# EAGLE schematic CPU (EAGLE 7.5.0), part 5 of 7
## Module OR_MATRIX
Ports: LOAD_A_FROM_DATABUS_SETAB(in) LOAD_A_FROM_DATABUS_MOV_ALU_C_TO_AB(in) LOAD_A_FROM_DATABUS_MOV_ALU_IN(in) LOAD_A_FROM_DATABUS(out) LOAD_B_FROM_DATABUS_MOV_ALU_IN(in) LOAD_B_FROM_DATABUS_SETAB(in) LOAD_B_FROM_DATABUS_MOV_ALU_C_TO_AB(in) LOAD_B_FROM_DATABUS(out) LOAD_C_FROM_DATABUS(out) LOAD_C_FROM_DATABUS_ALU(in) LOAD_D_FROM_DATABUS_MOV_ALU_OUT(in) LOAD_D_FROM_DATABUS_LOAD(in) LOAD_D_FROM_DATABUS_MOV(in) LOAD_D_FROM_DATABUS(out) LOAD_E_FROM_DATABUS_MOV_ALU_OUT(in) LOAD_E_FROM_DATABUS_LOAD(in) LOAD_E_FROM_DATABUS_MOV(in) LOAD_E_FROM_DATABUS(out) LOAD_F_FROM_DATABUS_MOV(in) LOAD_F_FROM_DATABUS_LOAD(in) LOAD_F_FROM_DATABUS_MOV_ALU_OUT(in) LOAD_F_FROM_DATABUS(out) LOAD_G_FROM_DATABUS_MOV(in) LOAD_G_FROM_DATABUS_LOAD(in) LOAD_G_FROM_DATABUS_MOV_ALU_OUT(in) LOAD_G_FROM_DATABUS(out) LOAD_H_FROM_DATABUS_MOV(in) LOAD_H_FROM_DATABUS_LOAD(in) LOAD_H_FROM_DATABUS_MOV_ALU_OUT(in) LOAD_H_FROM_DATABUS(out) LOAD_XL_FROM_DATABUS_MOV(in) LOAD_XL_FROM_DATABUS_LOAD(in) LOAD_XL_FROM_DATABUS_MOV_ALU_OUT(in) LOAD_XL_FROM_DATABUS_IN(in) LOAD_XL_FROM_DATABUS(out) LOAD_XH_FROM_DATABUS_MOV(in) LOAD_XH_FROM_DATABUS_LOAD(in) LOAD_XH_FROM_DATABUS_MOV_ALU_OUT(in) LOAD_XH_FROM_DATABUS(out) LOAD_M_FROM_ADDRESSBUS_MOV16(in) LOAD_M_FROM_ADDRESSBUS(out) LOAD_X_FROM_ADDRESSBUS_MOV16(in) LOAD_X_FROM_ADDRESSBUS_ADDER_16BIT(in) LOAD_X_FROM_ADDRESSBUS(out) LOAD_J_FROM_ADDRESSBUS_MOV16(in) LOAD_J_FROM_ADDRESSBUS(out) LOAD_SP_FROM_ADDRESSBUS_MOV16(in) LOAD_SP_FROM_ADDRESSBUS(out) LOAD_BP_FROM_ADDRESSBUS_MOV16(in) LOAD_BP_FROM_ADDRESSBUS(out) LOAD_Y_FROM_ADDRESSBUS_MOV16(in) LOAD_Z_FROM_ADDRESSBUS_MOV16(in) LOAD_Y_FROM_ADDRESSBUS(out) LOAD_Z_FROM_ADDRESSBUS(out) SELECT_C_TO_DATABUS_MOV_ALU_OUT(in) SELECT_C_TO_DATABUS_MOV_ALU_C_TO_AB(in) SELECT_C_TO_DATABUS(out) SELECT_D_TO_DATABUS_MOV_ALU_IN(in) SELECT_D_TO_DATABUS_MOV(in) SELECT_D_TO_DATABUS_STORE(in) SELECT_D_TO_DATABUS(out) SELECT_E_TO_DATABUS_MOV(in) SELECT_E_TO_DATABUS_STORE(in) SELECT_E_TO_DATABUS_MOV_ALU_IN(in) SELECT_E_TO_DATABUS(out) SELECT_F_TO_DATABUS_MOV(in) SELECT_F_TO_DATABUS_STORE(in) SELECT_F_TO_DATABUS_MOV_ALU_IN(in) SELECT_F_TO_DATABUS(out) SELECT_G_TO_DATABUS_MOV_ALU_IN(in) SELECT_G_TO_DATABUS_MOV(in) SELECT_G_TO_DATABUS_STORE(in) SELECT_G_TO_DATABUS(out) SELECT_H_TO_DATABUS_MOV_ALU_IN(in) SELECT_H_TO_DATABUS_MOV(in) SELECT_H_TO_DATABUS_STORE(in) SELECT_H_TO_DATABUS(out) SELECT_XL_TO_DATABUS_MOV_ALU_IN(in) SELECT_XL_TO_DATABUS_MOV(in) SELECT_XL_TO_DATABUS_STORE(in) SELECT_XL_TO_DATABUS_OUT(in) SELECT_XL_TO_DATABUS(out) SELECT_XH_TO_DATABUS_MOV_ALU_IN(in) SELECT_XH_TO_DATABUS_MOV(in) SELECT_XH_TO_DATABUS_STORE(in) SELECT_XH_TO_DATABUS(out) SELECT_M_TO_ADDRESSBUS_MOV16(in) SELECT_M_TO_ADDRESSBUS_LOAD(in) SELECT_M_TO_ADDRESSBUS_STORE(in) SELECT_M_TO_ADDRESSBUS_STORE_FLAGS(in) SELECT_M_TO_ADDRESSBUS_LOAD_FLAGS(in) SELECT_X_TO_ADDRESSBUS_MOV16(in) SELECT_X_TO_ADDRESSBUS_ADDER_16BIT(in) SELECT_M_TO_ADDRESSBUS(out) SELECT_X_TO_ADDRESSBUS(out) SELECT_SP_TO_ADDRESSBUS_MOV16(in) SELECT_SP_TO_ADDRESSBUS(out) SELECT_BP_TO_ADDRESSBUS_MOV16(in) SELECT_BP_TO_ADDRESSBUS(out) SELECT_Y_TO_ADDRESSBUS_MOV16(in) SELECT_Z_TO_ADDRESSBUS_MOV16(in) SELECT_Y_TO_ADDRESSBUS(out) SELECT_Z_TO_ADDRESSBUS(out) SELECT_J_TO_ADDRESSBUS_MOV16(in) SELECT_J_TO_ADDRESSBUS_JMP(in) SELECT_J_TO_ADDRESSBUS_JZ(in) SELECT_J_TO_ADDRESSBUS_JNS(in) SELECT_J_TO_ADDRESSBUS_JNZ(in) SELECT_J_TO_ADDRESSBUS_JNC(in) SELECT_J_TO_ADDRESSBUS_ADDER_16BIT(in) SELECT_J_TO_ADDRESSBUS(out) SELECT_FLAGS_JZ(in) SELECT_FLAGS_JNC(in) SELECT_FLAGS_JNS(in) SELECT_FLAGS_JNZ(in) SELECT_FLAGS_FLAGS_TO_OUTBUFFER(in) SELECT_FLAGS_SAVE_FLAGS(in) SELECT_FLAGS(out) LOAD_FLAGS_FROM_ALU(in) LOAD_FLAGS_INBUFFER_TO_FLAGS(in) LOAD_FLAGS_SAVE_FLAGS(in) LOAD_FLAGS(out) SELECT_SRAM_FETCH(in) SELECT_SRAM_LOAD(in) SELECT_SRAM_LOAD_FLAGS(in) SELECT_SRAM(out) LOAD_SRAM_STORE(in) LOAD_SRAM_STORE_FLAGS(in) LOAD_SRAM(out) LOAD_PC_FETCH(in) LOAD_PC_JMP(in) LOAD_PC_JZ(in) LOAD_PC_JNS(in) LOAD_PC_JNC(in) LOAD_PC_JNZ(in) LOAD_PC(out) SELECT_PC_FETCH(in) SELECT_PC(out) SELECT_FLAGSTOFLAGSBUS_INBUFFER_TO_FLAGS(in) SELECT_FLAGSTOFLAGSBUS(out) SELECT_FLAGS_TO_DATABUS_STORE_FLAGS(in) SELECT_FLAGS_TO_DATABUS(out) LOAD_FLAGS_FROM_DATABUS_LOAD_FLAGS(in) LOAD_FLAGS_FROM_DATABUS(out) LOAD_FLAGSSAVED_TO_FLAGS_REGISTER_RESTORE_FLAGS(in) LOAD_FLAGSSAVED_TO_FLAGS_REGISTER(out) LOAD_FLAGSSAVED_FROM_FLAGS_REGISTER_SAVE_FLAGS(in) LOAD_FLAGSSAVED_FROM_FLAGS_REGISTER(out) LOAD_PORTC_FROM_DATABUS_OUT(in) LOAD_PORTD_FROM_DATABUS_OUT(in) LOAD_PORTC_FROM_DATABUS(out) LOAD_PORTD_FROM_DATABUS(out) SELECT_PORTA_TO_DATABUS_IN(in) SELECT_PORTB_TO_DATABUS_IN(in) SELECT_PORTA_TO_DATABUS(out) SELECT_PORTB_TO_DATABUS(out) LOAD_ADDER16BIT_INPUTA_ADDER16BIT(in) LOAD_ADDER16BIT_INPUTB_ADDER16BIT(in) LOAD_ADDER16BIT_INPUTA(out) LOAD_ADDER16BIT_INPUTB(out) SELECT_ADDER16BIT_INPUTA_ADDER16BIT(in) SELECT_ADDER16BIT_INPUTB_ADDER16BIT(in) SELECT_ADDER16BIT_INPUTA(out) SELECT_ADDER16BIT_INPUTB(out) LOAD_ADDER16BIT_OUTPUTC_ADDER16BIT(in) SELECT_ADDER16BIT_OUTPUTC_ADDER16BIT(in) LOAD_ADDER16BIT_OUTPUTC(out) SELECT_ADDER16BIT_OUTPUTC(out) ENABLE_ALU_DECODER_ALU(in) SELECT_INSTRUCTION_TO_ALU_ALU(in) SELECT_B_TO_ALU_ALU(in) SELECT_A_TO_ALU_ALU(in) SELECT_A_TO_ALU(out) SELECT_B_TO_ALU(out) LOAD_INTERNALA_FROM_DATABUS_SETAB(in) LOAD_INTERNALA_FROM_DATABUS(out) SELECT_INTERNALA_TO_DATABUS_SETAB(in) SELECT_INTERNALA_TO_DATABUS(out) SELECT_INSTR_TO_DATABUS_SETAB(in) SELECT_INSTR_TO_DATABUS(out) STOPCPU_HLT(in) STOPCPU(out) LOAD_INSTRUCTION_FETCH(in) LOAD_INSTRUCTION(out) SELECT_INC_FETCH(in) SELECT_INC(out) LOAD_INC_FETCH(in) LOAD_INC(out) INCREMENTER_FETCH(in) INCREMENTER(out) LOAD_FLAGS_FROM_FLAGSBUS_FLAGS_TO_OUTBUFFER(in) LOAD_FLAGS_FROM_FLAGSBUS(out) SELECT_XE_TO_DATABUS_MOV_ALU_IN(in) SELECT_XE_TO_DATABUS_MOV(in) SELECT_XE_TO_DATABUS_STORE(in) SELECT_XE_TO_DATABUS(out) LOAD_XE_FROM_DATABUS_MOV_ALU_OUT(in) LOAD_XE_FROM_DATABUS_LOAD(in) LOAD_XE_FROM_DATABUS_MOV(in) LOAD_XE_FROM_DATABUS(out) ALU_INSTRUCTION(out)
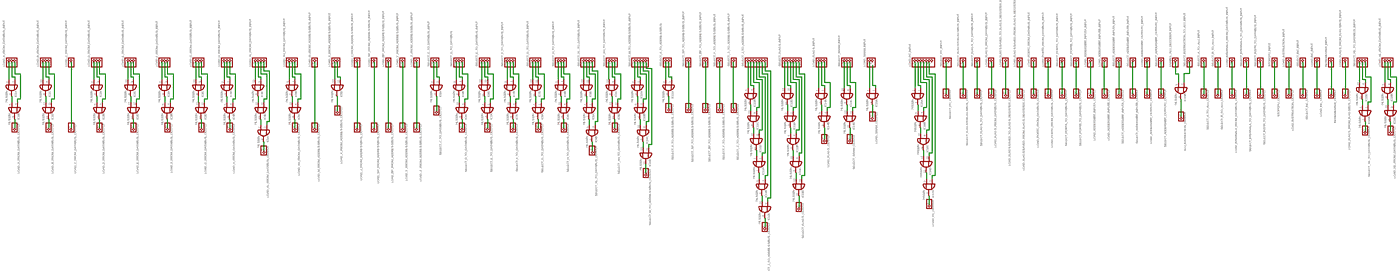
[diagram p74: schematic, module OR_MATRIX, sheet 1, overview]
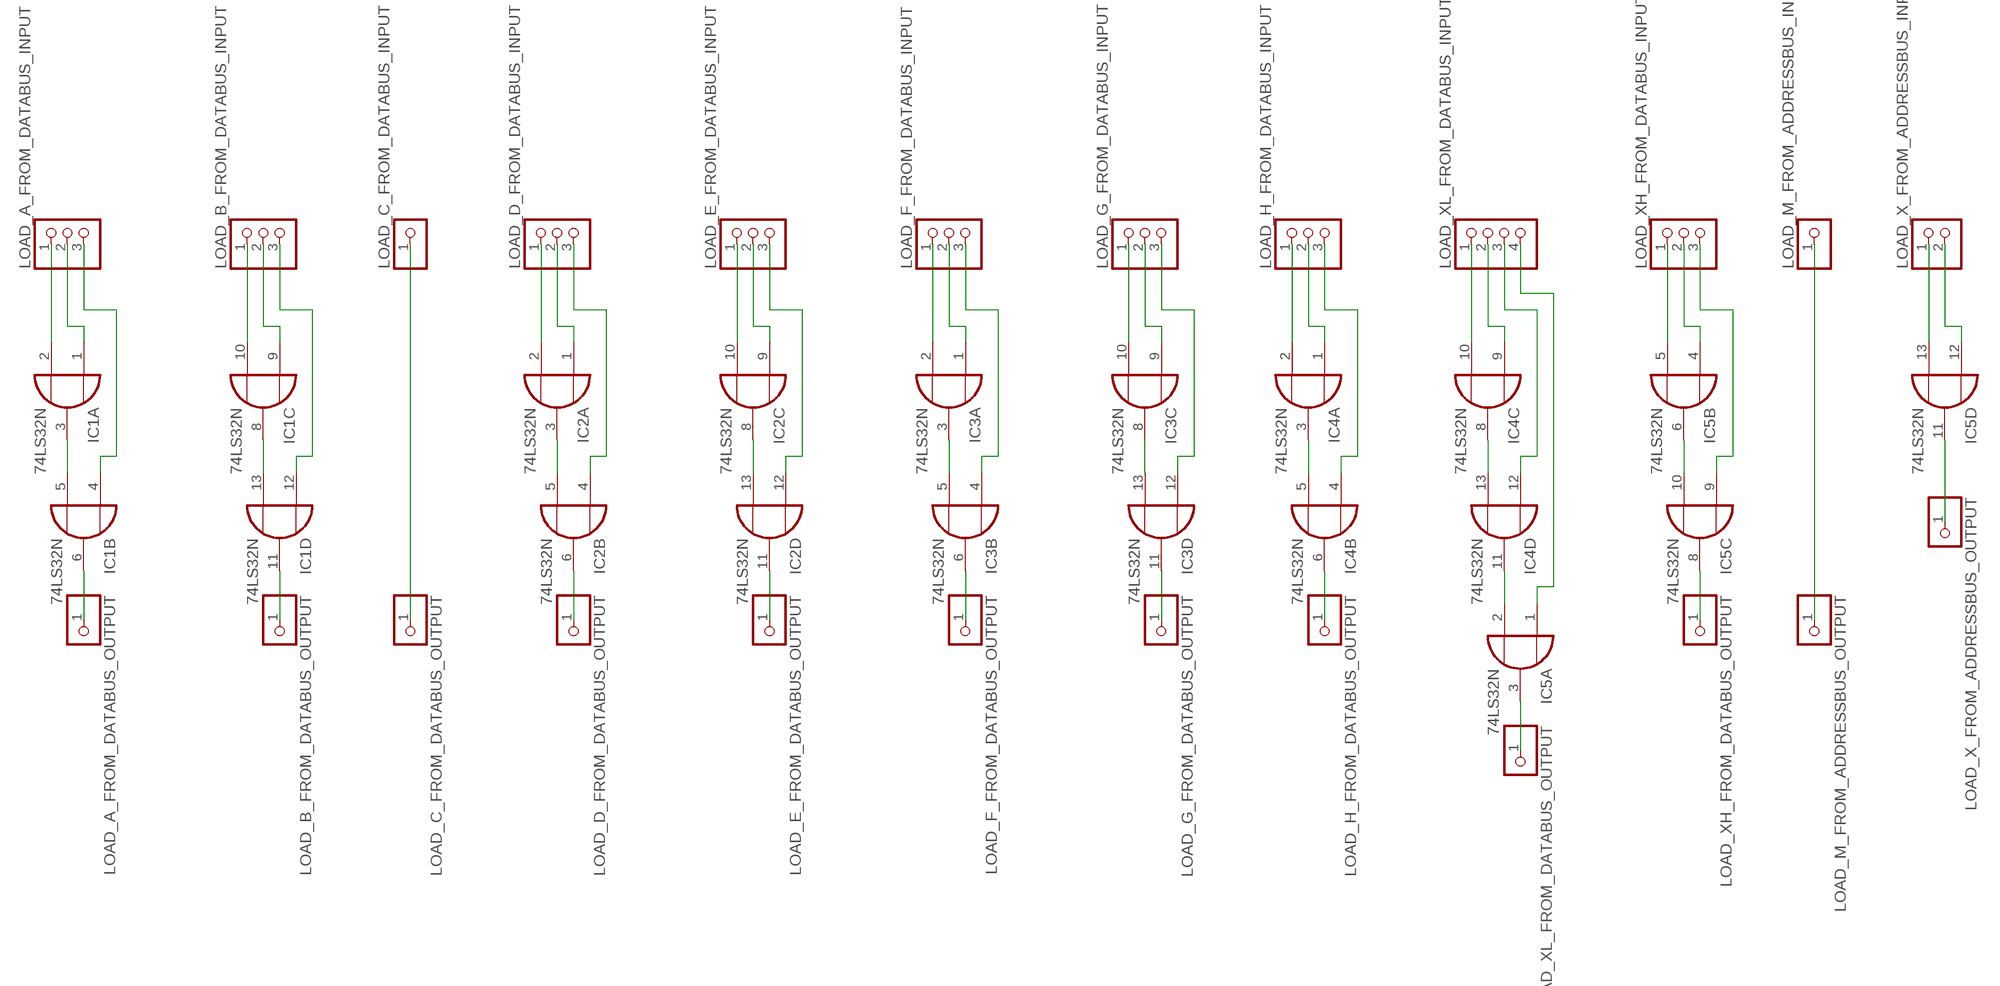
[diagram p75: schematic, module OR_MATRIX, sheet 1, part 1 of 4]
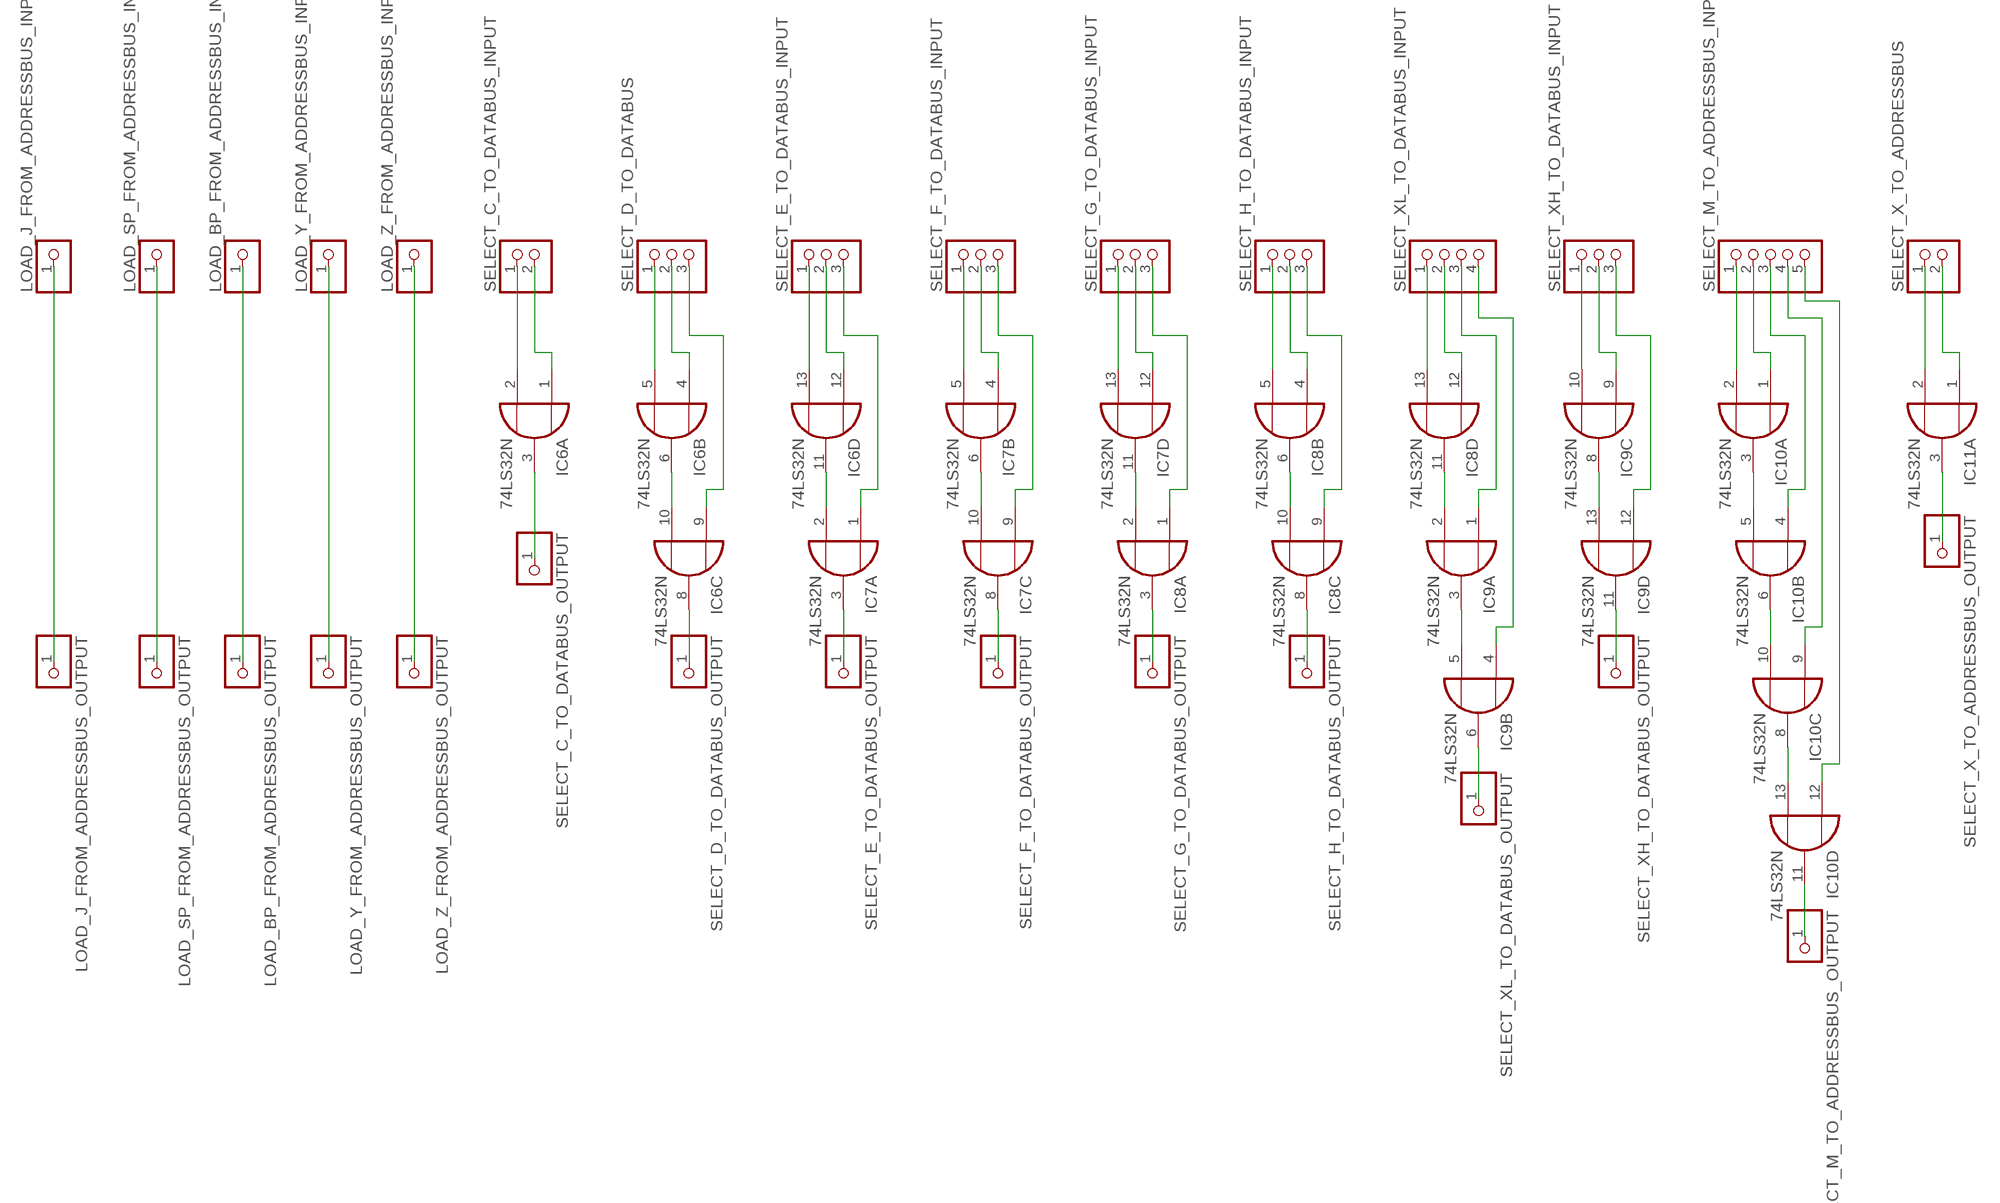
[diagram p76: schematic, module OR_MATRIX, sheet 1, part 2 of 4]
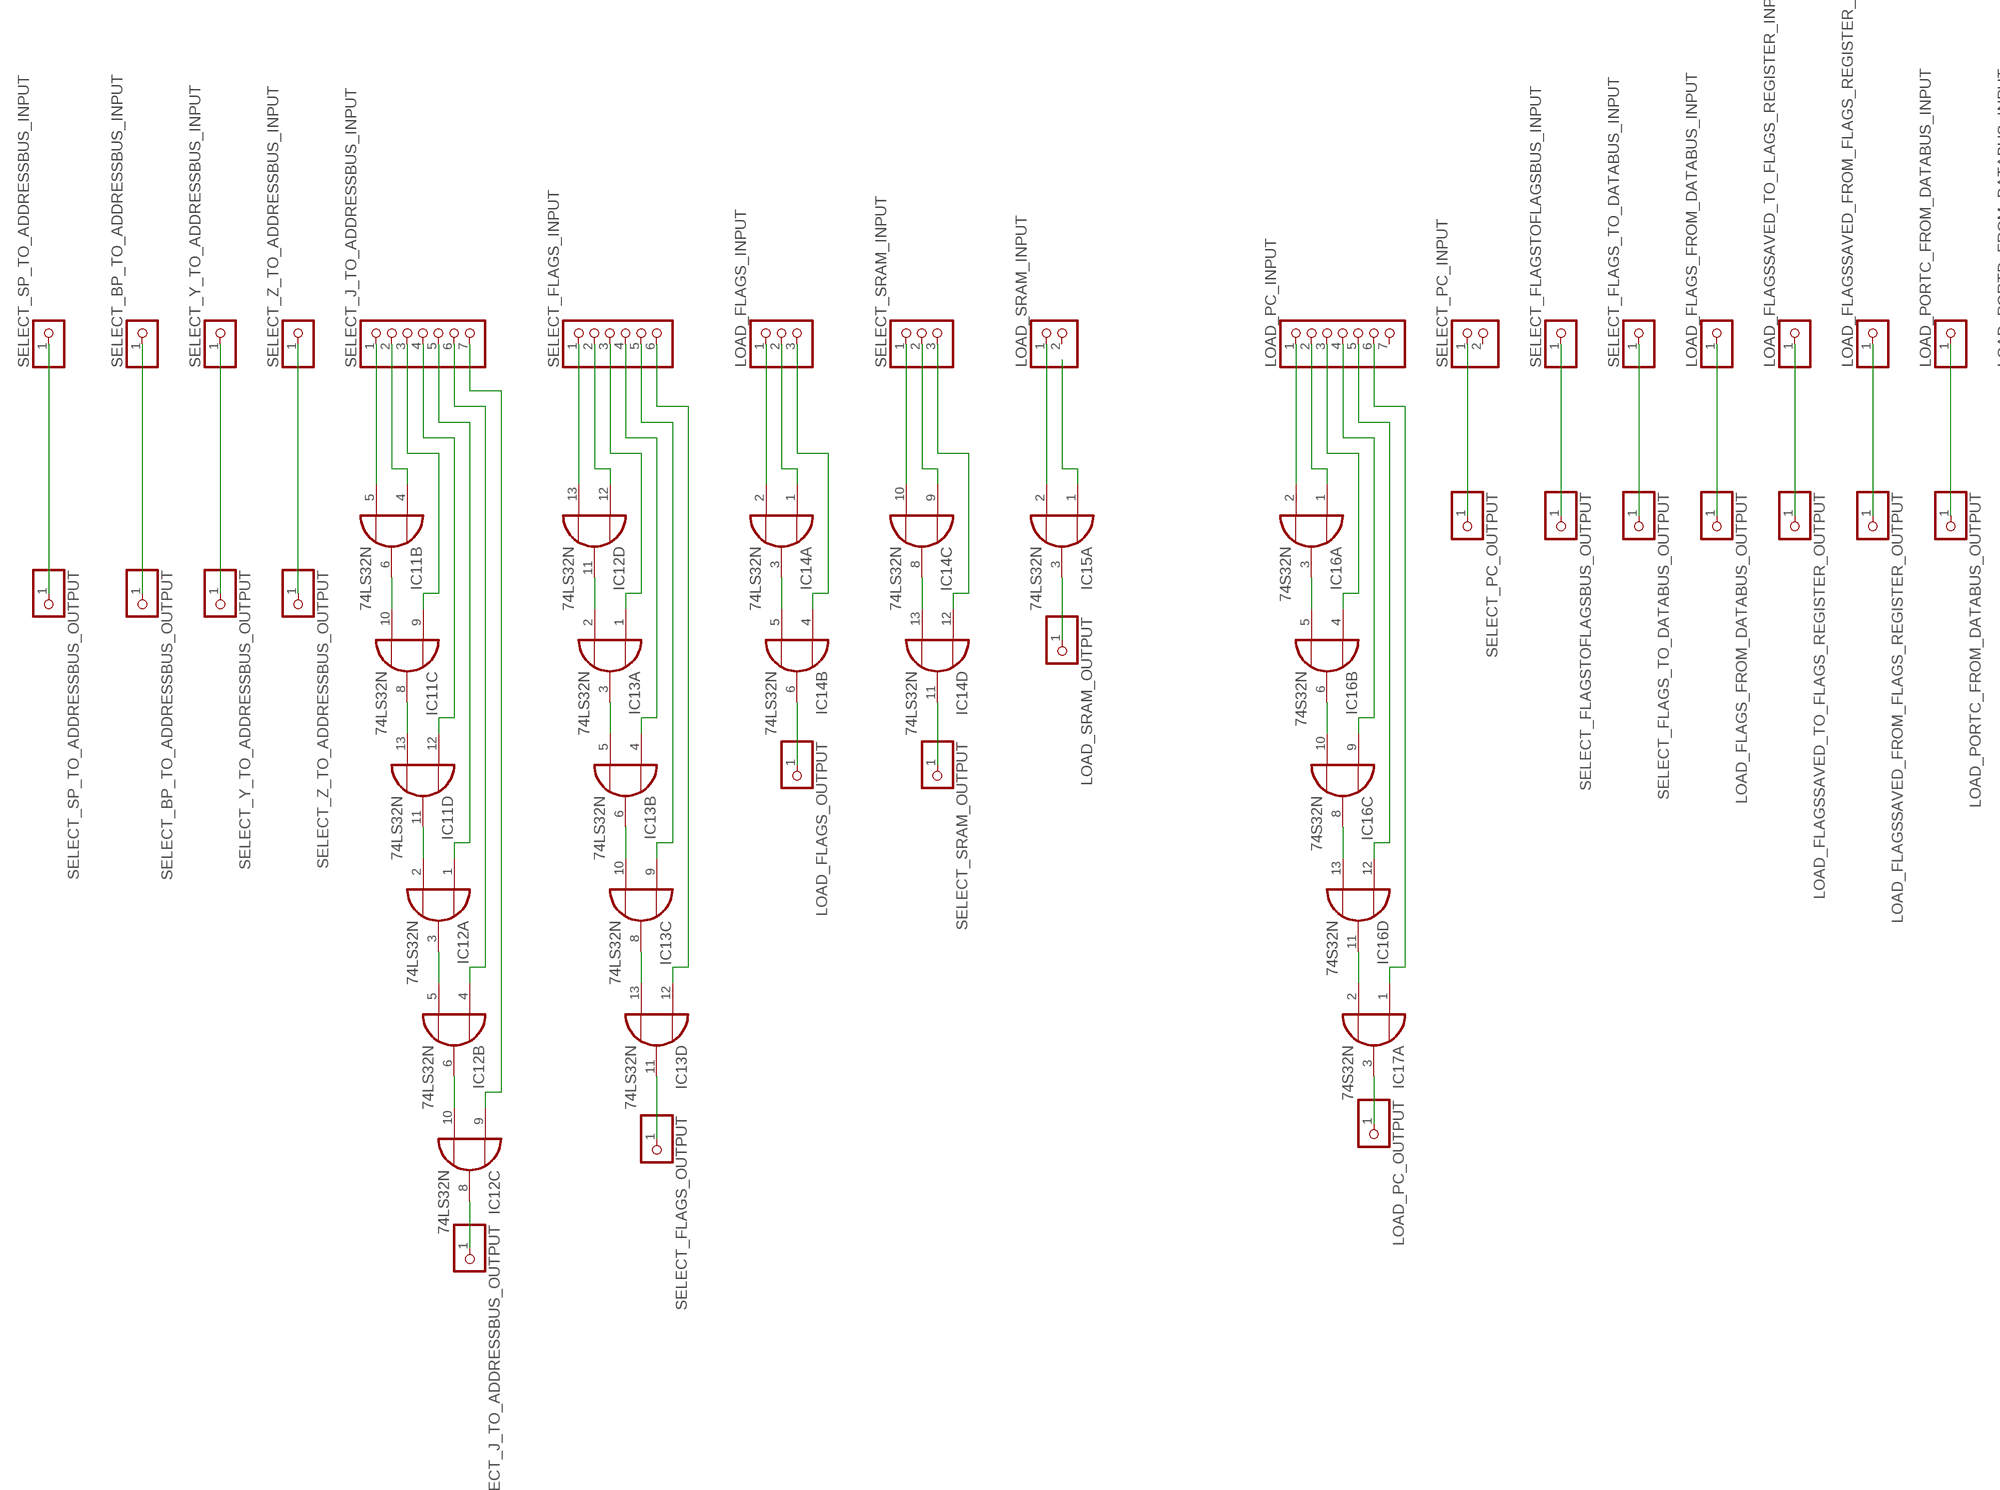
[diagram p77: schematic, module OR_MATRIX, sheet 1, part 3 of 4]
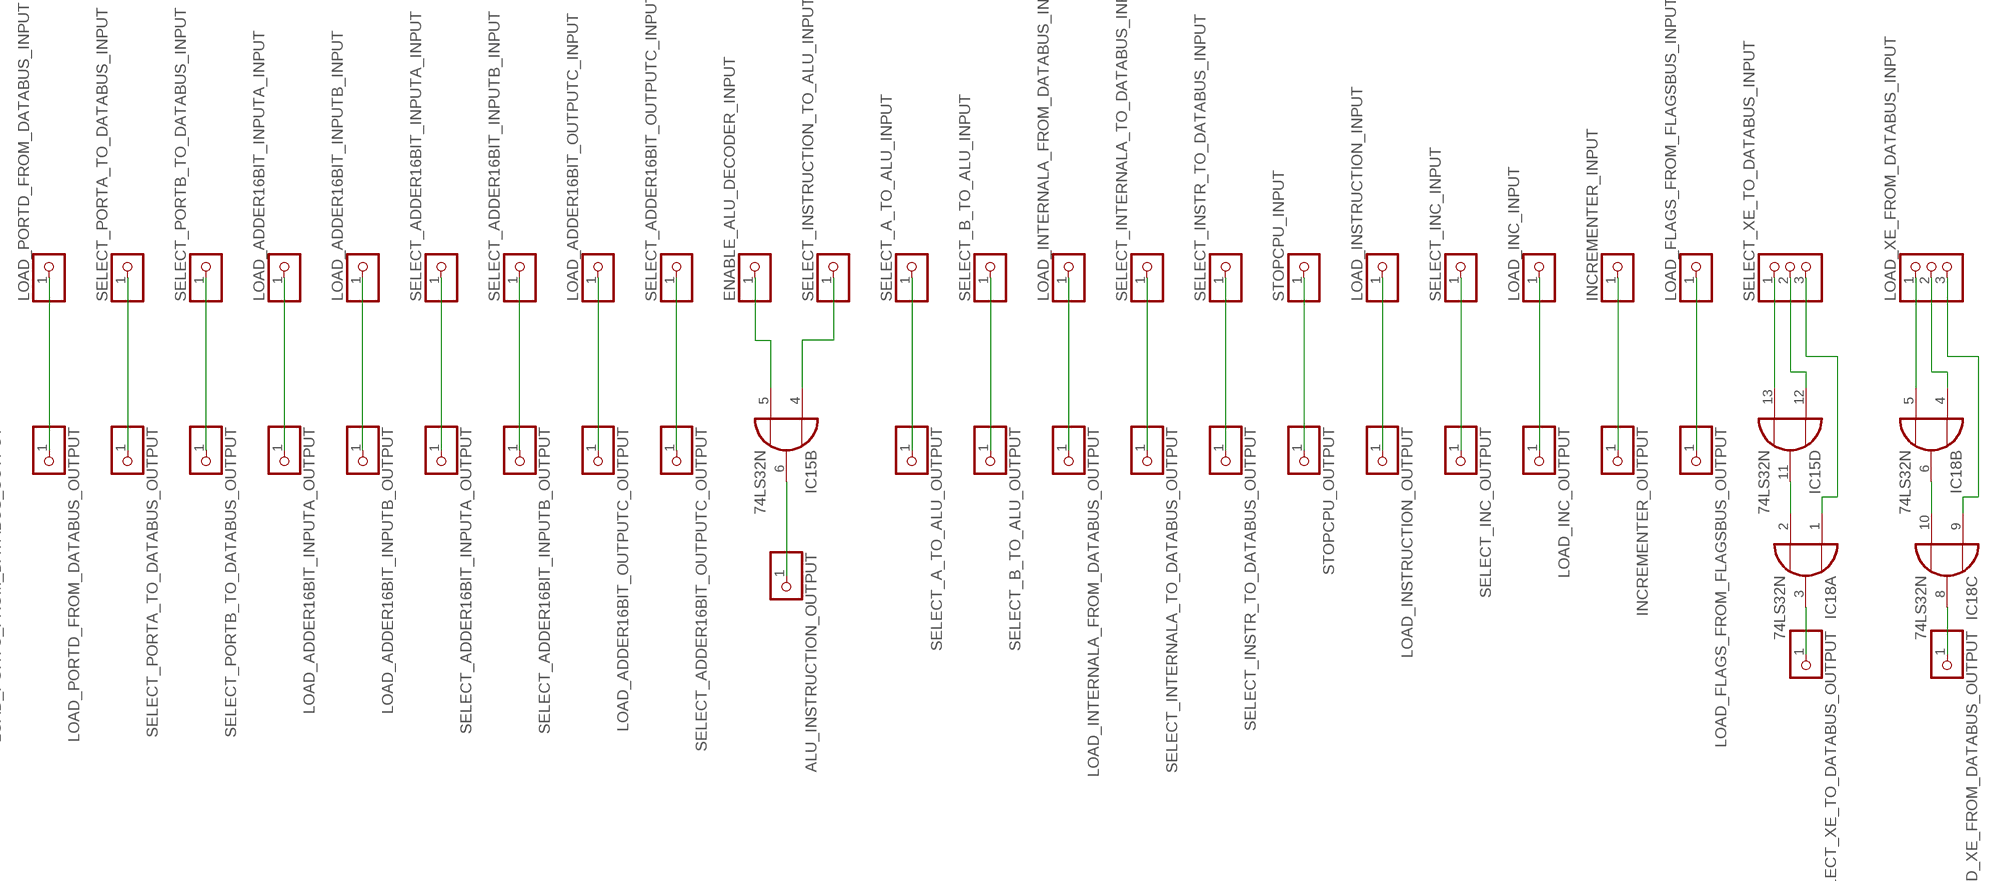
[diagram p78: schematic, module OR_MATRIX, sheet 1, part 4 of 4]

### Parts
ALU_INSTRUCTION_OUTPUT  PINHD-1X1  [1X01]
ENABLE_ALU_DECODER_INPUT  PINHD-1X1  [1X01]
IC1  74LS32N  [DIL14]
IC2  74LS32N  [DIL14]
IC3  74LS32N  [DIL14]
IC4  74LS32N  [DIL14]
IC5  74LS32N  [DIL14]
IC6  74LS32N  [DIL14]
IC7  74LS32N  [DIL14]
IC8  74LS32N  [DIL14]
IC9  74LS32N  [DIL14]
IC10  74LS32N  [DIL14]
IC11  74LS32N  [DIL14]
IC12  74LS32N  [DIL14]
IC13  74LS32N  [DIL14]
IC14  74LS32N  [DIL14]
IC15  74LS32N  [DIL14]
IC16  74S32N  [DIL14]
IC17  74S32N  [DIL14]
IC18  74LS32N  [DIL14]
INCREMENTER_INPUT  PINHD-1X1  [1X01]
INCREMENTER_OUTPUT  PINHD-1X1  [1X01]
LOAD_A_FROM_DATABUS_INPUT  PINHD-1X3  [1X03]
LOAD_A_FROM_DATABUS_OUTPUT  PINHD-1X1  [1X01]
LOAD_ADDER16BIT_INPUTA_INPUT  PINHD-1X1  [1X01]
LOAD_ADDER16BIT_INPUTA_OUTPUT  PINHD-1X1  [1X01]
LOAD_ADDER16BIT_INPUTB_INPUT  PINHD-1X1  [1X01]
LOAD_ADDER16BIT_INPUTB_OUTPUT  PINHD-1X1  [1X01]
LOAD_ADDER16BIT_OUTPUTC_INPUT  PINHD-1X1  [1X01]
LOAD_ADDER16BIT_OUTPUTC_OUTPUT  PINHD-1X1  [1X01]
LOAD_B_FROM_DATABUS_INPUT  PINHD-1X3  [1X03]
LOAD_B_FROM_DATABUS_OUTPUT  PINHD-1X1  [1X01]
LOAD_BP_FROM_ADDRESSBUS_INPUT  PINHD-1X1  [1X01]
LOAD_BP_FROM_ADDRESSBUS_OUTPUT  PINHD-1X1  [1X01]
LOAD_C_FROM_DATABUS_INPUT  PINHD-1X1  [1X01]
LOAD_C_FROM_DATABUS_OUTPUT  PINHD-1X1  [1X01]
LOAD_D_FROM_DATABUS_INPUT  PINHD-1X3  [1X03]
LOAD_D_FROM_DATABUS_OUTPUT  PINHD-1X1  [1X01]
LOAD_E_FROM_DATABUS_INPUT  PINHD-1X3  [1X03]
LOAD_E_FROM_DATABUS_OUTPUT  PINHD-1X1  [1X01]
LOAD_F_FROM_DATABUS_INPUT  PINHD-1X3  [1X03]
LOAD_F_FROM_DATABUS_OUTPUT  PINHD-1X1  [1X01]
LOAD_FLAGS_FROM_DATABUS_INPUT  PINHD-1X1  [1X01]
LOAD_FLAGS_FROM_DATABUS_OUTPUT  PINHD-1X1  [1X01]
LOAD_FLAGS_FROM_FLAGSBUS_INPUT  PINHD-1X1  [1X01]
LOAD_FLAGS_FROM_FLAGSBUS_OUTPUT  PINHD-1X1  [1X01]
LOAD_FLAGS_INPUT  PINHD-1X3  [1X03]
LOAD_FLAGS_OUTPUT  PINHD-1X1  [1X01]
LOAD_FLAGSSAVED_FROM_FLAGS_REGISTER_INPUT  PINHD-1X1  [1X01]
LOAD_FLAGSSAVED_FROM_FLAGS_REGISTER_OUTPUT  PINHD-1X1  [1X01]
LOAD_FLAGSSAVED_TO_FLAGS_REGISTER_INPUT  PINHD-1X1  [1X01]
LOAD_FLAGSSAVED_TO_FLAGS_REGISTER_OUTPUT  PINHD-1X1  [1X01]
LOAD_G_FROM_DATABUS_INPUT  PINHD-1X3  [1X03]
LOAD_G_FROM_DATABUS_OUTPUT  PINHD-1X1  [1X01]
LOAD_H_FROM_DATABUS_INPUT  PINHD-1X3  [1X03]
LOAD_H_FROM_DATABUS_OUTPUT  PINHD-1X1  [1X01]
LOAD_INC_INPUT  PINHD-1X1  [1X01]
LOAD_INC_OUTPUT  PINHD-1X1  [1X01]
LOAD_INSTRUCTION_INPUT  PINHD-1X1  [1X01]
LOAD_INSTRUCTION_OUTPUT  PINHD-1X1  [1X01]
LOAD_INTERNALA_FROM_DATABUS_INPUT  PINHD-1X1  [1X01]
LOAD_INTERNALA_FROM_DATABUS_OUTPUT  PINHD-1X1  [1X01]
LOAD_J_FROM_ADDRESSBUS_INPUT  PINHD-1X1  [1X01]
LOAD_J_FROM_ADDRESSBUS_OUTPUT  PINHD-1X1  [1X01]
LOAD_M_FROM_ADDRESSBUS_INPUT  PINHD-1X1  [1X01]
LOAD_M_FROM_ADDRESSBUS_OUTPUT  PINHD-1X1  [1X01]
LOAD_PC_INPUT  PINHD-1X7  [1X07]
LOAD_PC_OUTPUT  PINHD-1X1  [1X01]
LOAD_PORTC_FROM_DATABUS_INPUT  PINHD-1X1  [1X01]
LOAD_PORTC_FROM_DATABUS_OUTPUT  PINHD-1X1  [1X01]
LOAD_PORTD_FROM_DATABUS_INPUT  PINHD-1X1  [1X01]
LOAD_PORTD_FROM_DATABUS_OUTPUT  PINHD-1X1  [1X01]
LOAD_SP_FROM_ADDRESSBUS_INPUT  PINHD-1X1  [1X01]
LOAD_SP_FROM_ADDRESSBUS_OUTPUT  PINHD-1X1  [1X01]
LOAD_SRAM_INPUT  PINHD-1X2  [1X02]
LOAD_SRAM_OUTPUT  PINHD-1X1  [1X01]
LOAD_X_FROM_ADDRESSBUS_INPUT  PINHD-1X2  [1X02]
LOAD_X_FROM_ADDRESSBUS_OUTPUT  PINHD-1X1  [1X01]
LOAD_XE_FROM_DATABUS_INPUT  PINHD-1X3  [1X03]
LOAD_XE_FROM_DATABUS_OUTPUT  PINHD-1X1  [1X01]
LOAD_XH_FROM_DATABUS_INPUT  PINHD-1X3  [1X03]
LOAD_XH_FROM_DATABUS_OUTPUT  PINHD-1X1  [1X01]
LOAD_XL_FROM_DATABUS_INPUT  PINHD-1X4  [1X04]
LOAD_XL_FROM_DATABUS_OUTPUT  PINHD-1X1  [1X01]
LOAD_Y_FROM_ADDRESSBUS_INPUT  PINHD-1X1  [1X01]
LOAD_Y_FROM_ADDRESSBUS_OUTPUT  PINHD-1X1  [1X01]
LOAD_Z_FROM_ADDRESSBUS_INPUT  PINHD-1X1  [1X01]
LOAD_Z_FROM_ADDRESSBUS_OUTPUT  PINHD-1X1  [1X01]
SELECT_A_TO_ALU_INPUT  PINHD-1X1  [1X01]
SELECT_A_TO_ALU_OUTPUT  PINHD-1X1  [1X01]
SELECT_ADDER16BIT_INPUTA_INPUT  PINHD-1X1  [1X01]
SELECT_ADDER16BIT_INPUTA_OUTPUT  PINHD-1X1  [1X01]
SELECT_ADDER16BIT_INPUTB_INPUT  PINHD-1X1  [1X01]
SELECT_ADDER16BIT_INPUTB_OUTPUT  PINHD-1X1  [1X01]
SELECT_ADDER16BIT_OUTPUTC_INPUT  PINHD-1X1  [1X01]
SELECT_ADDER16BIT_OUTPUTC_OUTPUT  PINHD-1X1  [1X01]
SELECT_B_TO_ALU_INPUT  PINHD-1X1  [1X01]
SELECT_B_TO_ALU_OUTPUT  PINHD-1X1  [1X01]
SELECT_BP_TO_ADDRESSBUS_INPUT  PINHD-1X1  [1X01]
SELECT_BP_TO_ADDRESSBUS_OUTPUT  PINHD-1X1  [1X01]
SELECT_C_TO_DATABUS_INPUT  PINHD-1X2  [1X02]
SELECT_C_TO_DATABUS_OUTPUT  PINHD-1X1  [1X01]
SELECT_D_TO_DATABUS  PINHD-1X3  [1X03]
SELECT_D_TO_DATABUS_OUTPUT  PINHD-1X1  [1X01]
SELECT_E_TO_DATABUS_INPUT  PINHD-1X3  [1X03]
SELECT_E_TO_DATABUS_OUTPUT  PINHD-1X1  [1X01]
SELECT_F_TO_DATABUS_INPUT  PINHD-1X3  [1X03]
SELECT_F_TO_DATABUS_OUTPUT  PINHD-1X1  [1X01]
SELECT_FLAGS_INPUT  PINHD-1X6  [1X06]
SELECT_FLAGS_OUTPUT  PINHD-1X1  [1X01]
SELECT_FLAGS_TO_DATABUS_INPUT  PINHD-1X1  [1X01]
SELECT_FLAGS_TO_DATABUS_OUTPUT  PINHD-1X1  [1X01]
SELECT_FLAGSTOFLAGSBUS_INPUT  PINHD-1X1  [1X01]
SELECT_FLAGSTOFLAGSBUS_OUTPUT  PINHD-1X1  [1X01]
SELECT_G_TO_DATABUS_INPUT  PINHD-1X3  [1X03]
SELECT_G_TO_DATABUS_OUTPUT  PINHD-1X1  [1X01]
SELECT_H_TO_DATABUS_INPUT  PINHD-1X3  [1X03]
SELECT_H_TO_DATABUS_OUTPUT  PINHD-1X1  [1X01]
SELECT_INC_INPUT  PINHD-1X1  [1X01]
SELECT_INC_OUTPUT  PINHD-1X1  [1X01]
SELECT_INSTR_TO_DATABUS_INPUT  PINHD-1X1  [1X01]
SELECT_INSTR_TO_DATABUS_OUTPUT  PINHD-1X1  [1X01]
SELECT_INSTRUCTION_TO_ALU_INPUT  PINHD-1X1  [1X01]
SELECT_INTERNALA_TO_DATABUS_INPUT  PINHD-1X1  [1X01]
SELECT_INTERNALA_TO_DATABUS_OUTPUT  PINHD-1X1  [1X01]
SELECT_J_TO_ADDRESSBUS_INPUT  PINHD-1X7  [1X07]
SELECT_J_TO_ADDRESSBUS_OUTPUT  PINHD-1X1  [1X01]
SELECT_M_TO_ADDRESSBUS_INPUT  PINHD-1X5  [1X05]
SELECT_M_TO_ADDRESSBUS_OUTPUT  PINHD-1X1  [1X01]
SELECT_PC_INPUT  PINHD-1X2  [1X02]
SELECT_PC_OUTPUT  PINHD-1X1  [1X01]
SELECT_PORTA_TO_DATABUS_INPUT  PINHD-1X1  [1X01]
SELECT_PORTA_TO_DATABUS_OUTPUT  PINHD-1X1  [1X01]
SELECT_PORTB_TO_DATABUS_INPUT  PINHD-1X1  [1X01]
SELECT_PORTB_TO_DATABUS_OUTPUT  PINHD-1X1  [1X01]
SELECT_SP_TO_ADDRESSBUS_INPUT  PINHD-1X1  [1X01]
SELECT_SP_TO_ADDRESSBUS_OUTPUT  PINHD-1X1  [1X01]
SELECT_SRAM_INPUT  PINHD-1X3  [1X03]
SELECT_SRAM_OUTPUT  PINHD-1X1  [1X01]
SELECT_X_TO_ADDRESSBUS  PINHD-1X2  [1X02]
SELECT_X_TO_ADDRESSBUS_OUTPUT  PINHD-1X1  [1X01]
SELECT_XE_TO_DATABUS_INPUT  PINHD-1X3  [1X03]
SELECT_XE_TO_DATABUS_OUTPUT  PINHD-1X1  [1X01]
SELECT_XH_TO_DATABUS_INPUT  PINHD-1X3  [1X03]
SELECT_XH_TO_DATABUS_OUTPUT  PINHD-1X1  [1X01]
SELECT_XL_TO_DATABUS_INPUT  PINHD-1X4  [1X04]
SELECT_XL_TO_DATABUS_OUTPUT  PINHD-1X1  [1X01]
SELECT_Y_TO_ADDRESSBUS_INPUT  PINHD-1X1  [1X01]
SELECT_Y_TO_ADDRESSBUS_OUTPUT  PINHD-1X1  [1X01]
SELECT_Z_TO_ADDRESSBUS_INPUT  PINHD-1X1  [1X01]
SELECT_Z_TO_ADDRESSBUS_OUTPUT  PINHD-1X1  [1X01]
STOPCPU_INPUT  PINHD-1X1  [1X01]
STOPCPU_OUTPUT  PINHD-1X1  [1X01]

### Nets
ALU_INSTRUCTION: ALU_INSTRUCTION_OUTPUT.1 IC15.6(B:O)
INCREMENTER: INCREMENTER_INPUT.1 INCREMENTER_OUTPUT.1
LOAD_A_FROM_DATABUS: IC1.6(B:O) LOAD_A_FROM_DATABUS_OUTPUT.1
LOAD_A_FROM_DATABUS_MOV_ALU_C_TO_AB: IC1.4(B:I0) LOAD_A_FROM_DATABUS_INPUT.3
LOAD_A_FROM_DATABUS_MOV_ALU_IN: IC1.1(A:I0) LOAD_A_FROM_DATABUS_INPUT.2
LOAD_A_FROM_DATABUS_SETAB: IC1.2(A:I1) LOAD_A_FROM_DATABUS_INPUT.1
LOAD_ADDER16BIT_INPUTA: LOAD_ADDER16BIT_INPUTA_INPUT.1 LOAD_ADDER16BIT_INPUTA_OUTPUT.1
LOAD_ADDER16BIT_INPUTB: LOAD_ADDER16BIT_INPUTB_INPUT.1 LOAD_ADDER16BIT_INPUTB_OUTPUT.1
LOAD_ADDER16BIT_OUTPUTC: LOAD_ADDER16BIT_OUTPUTC_INPUT.1 LOAD_ADDER16BIT_OUTPUTC_OUTPUT.1
LOAD_B_FROM_DATABUS: IC1.11(D:O) LOAD_B_FROM_DATABUS_OUTPUT.1
LOAD_B_FROM_DATABUS_MOV_ALU_C_TO_AB: IC1.12(D:I0) LOAD_B_FROM_DATABUS_INPUT.3
LOAD_B_FROM_DATABUS_MOV_ALU_IN: IC1.9(C:I0) LOAD_B_FROM_DATABUS_INPUT.2
LOAD_B_FROM_DATABUS_SETAB: IC1.10(C:I1) LOAD_B_FROM_DATABUS_INPUT.1
LOAD_BP_FROM_ADDRESSBUS: LOAD_BP_FROM_ADDRESSBUS_INPUT.1 LOAD_BP_FROM_ADDRESSBUS_OUTPUT.1
LOAD_C_FROM_DATABUS_ALU: LOAD_C_FROM_DATABUS_INPUT.1 LOAD_C_FROM_DATABUS_OUTPUT.1
LOAD_D_FROM_DATABUS: IC2.6(B:O) LOAD_D_FROM_DATABUS_OUTPUT.1
LOAD_D_FROM_DATABUS_LOAD: IC2.4(B:I0) LOAD_D_FROM_DATABUS_INPUT.3
LOAD_D_FROM_DATABUS_MOV: IC2.1(A:I0) LOAD_D_FROM_DATABUS_INPUT.2
LOAD_D_FROM_DATABUS_MOV_ALU_OUT: IC2.2(A:I1) LOAD_D_FROM_DATABUS_INPUT.1
LOAD_E_FROM_DATABUS: IC2.11(D:O) LOAD_E_FROM_DATABUS_OUTPUT.1
LOAD_E_FROM_DATABUS_LOAD: IC2.12(D:I0) LOAD_E_FROM_DATABUS_INPUT.3
LOAD_E_FROM_DATABUS_MOV: IC2.9(C:I0) LOAD_E_FROM_DATABUS_INPUT.2
LOAD_E_FROM_DATABUS_MOV_ALU_OUT: IC2.10(C:I1) LOAD_E_FROM_DATABUS_INPUT.1
LOAD_F_FROM_DATABUS: IC3.6(B:O) LOAD_F_FROM_DATABUS_OUTPUT.1
LOAD_F_FROM_DATABUS_LOAD: IC3.4(B:I0) LOAD_F_FROM_DATABUS_INPUT.3
LOAD_F_FROM_DATABUS_MOV: IC3.1(A:I0) LOAD_F_FROM_DATABUS_INPUT.2
LOAD_F_FROM_DATABUS_MOV_ALU_OUT: IC3.2(A:I1) LOAD_F_FROM_DATABUS_INPUT.1
LOAD_FLAGS: IC14.6(B:O) LOAD_FLAGS_OUTPUT.1
LOAD_FLAGS_FROM_ALU: IC14.2(A:I1) LOAD_FLAGS_INPUT.1
LOAD_FLAGS_FROM_DATABUS: LOAD_FLAGS_FROM_DATABUS_INPUT.1 LOAD_FLAGS_FROM_DATABUS_OUTPUT.1
LOAD_FLAGS_FROM_FLAGSBUS: LOAD_FLAGS_FROM_FLAGSBUS_INPUT.1 LOAD_FLAGS_FROM_FLAGSBUS_OUTPUT.1
LOAD_FLAGS_INBUFFER_TO_FLAGS: IC14.4(B:I0) LOAD_FLAGS_INPUT.3
LOAD_FLAGS_SAVE_FLAGS: IC14.1(A:I0) LOAD_FLAGS_INPUT.2
LOAD_FLAGSSAVED_FROM_FLAGS_REGISTER: LOAD_FLAGSSAVED_FROM_FLAGS_REGISTER_INPUT.1 LOAD_FLAGSSAVED_FROM_FLAGS_REGISTER_OUTPUT.1
LOAD_FLAGSSAVED_TO_FLAGS_REGISTER: LOAD_FLAGSSAVED_TO_FLAGS_REGISTER_INPUT.1 LOAD_FLAGSSAVED_TO_FLAGS_REGISTER_OUTPUT.1
LOAD_G_FROM_DATABUS: IC3.11(D:O) LOAD_G_FROM_DATABUS_OUTPUT.1
LOAD_G_FROM_DATABUS_LOAD: IC3.12(D:I0) LOAD_G_FROM_DATABUS_INPUT.3
LOAD_G_FROM_DATABUS_MOV: IC3.9(C:I0) LOAD_G_FROM_DATABUS_INPUT.2
LOAD_G_FROM_DATABUS_MOV_ALU_OUT: IC3.10(C:I1) LOAD_G_FROM_DATABUS_INPUT.1
LOAD_H_FROM_DATABUS: IC4.6(B:O) LOAD_H_FROM_DATABUS_OUTPUT.1
LOAD_H_FROM_DATABUS_LOAD: IC4.4(B:I0) LOAD_H_FROM_DATABUS_INPUT.3
LOAD_H_FROM_DATABUS_MOV: IC4.1(A:I0) LOAD_H_FROM_DATABUS_INPUT.2
LOAD_H_FROM_DATABUS_MOV_ALU_OUT: IC4.2(A:I1) LOAD_H_FROM_DATABUS_INPUT.1
LOAD_INC: LOAD_INC_INPUT.1 LOAD_INC_OUTPUT.1
LOAD_INSTRUCTION: LOAD_INSTRUCTION_INPUT.1 LOAD_INSTRUCTION_OUTPUT.1
LOAD_INTERNALA_FROM_DATABUS: LOAD_INTERNALA_FROM_DATABUS_INPUT.1 LOAD_INTERNALA_FROM_DATABUS_OUTPUT.1
LOAD_J_FROM_ADDRESSBUS: LOAD_J_FROM_ADDRESSBUS_INPUT.1 LOAD_J_FROM_ADDRESSBUS_OUTPUT.1
LOAD_M_FROM_ADDRESSBUS: LOAD_M_FROM_ADDRESSBUS_INPUT.1 LOAD_M_FROM_ADDRESSBUS_OUTPUT.1
LOAD_PC: LOAD_PC_OUTPUT.1
LOAD_PC_FETCH: IC16.2(A:I1) LOAD_PC_INPUT.1
LOAD_PC_JMP: IC16.1(A:I0) LOAD_PC_INPUT.2
LOAD_PC_JNC: IC17.1(A:I0) LOAD_PC_INPUT.6
LOAD_PC_JNS: IC16.9(C:I0) LOAD_PC_INPUT.4
LOAD_PC_JNZ: IC16.12(D:I0) LOAD_PC_INPUT.5
LOAD_PC_JZ: IC16.4(B:I0) LOAD_PC_INPUT.3
LOAD_PORTC_FROM_DATABUS: LOAD_PORTC_FROM_DATABUS_INPUT.1 LOAD_PORTC_FROM_DATABUS_OUTPUT.1
LOAD_PORTD_FROM_DATABUS: LOAD_PORTD_FROM_DATABUS_INPUT.1 LOAD_PORTD_FROM_DATABUS_OUTPUT.1
LOAD_SP_FROM_ADDRESSBUS: LOAD_SP_FROM_ADDRESSBUS_INPUT.1 LOAD_SP_FROM_ADDRESSBUS_OUTPUT.1
LOAD_SRAM: IC15.3(A:O) LOAD_SRAM_OUTPUT.1
LOAD_SRAM_STORE: IC15.2(A:I1) LOAD_SRAM_INPUT.1
LOAD_SRAM_STORE_FLAGS: IC15.1(A:I0)
LOAD_X_FROM_ADDRESSBUS: IC5.11(D:O) LOAD_X_FROM_ADDRESSBUS_OUTPUT.1
LOAD_X_FROM_ADDRESSBUS_ADDER_16BIT: IC5.12(D:I0) LOAD_X_FROM_ADDRESSBUS_INPUT.2
LOAD_X_FROM_ADDRESSBUS_MOV16: IC5.13(D:I1) LOAD_X_FROM_ADDRESSBUS_INPUT.1
LOAD_XE_FROM_DATABUS: IC18.8(C:O) LOAD_XE_FROM_DATABUS_OUTPUT.1
LOAD_XE_FROM_DATABUS_LOAD: IC18.9(C:I0) LOAD_XE_FROM_DATABUS_INPUT.3
LOAD_XE_FROM_DATABUS_MOV: IC18.4(B:I0) LOAD_XE_FROM_DATABUS_INPUT.2
LOAD_XE_FROM_DATABUS_MOV_ALU_OUT: IC18.5(B:I1) LOAD_XE_FROM_DATABUS_INPUT.1
LOAD_XH_FROM_DATABUS: IC5.8(C:O) LOAD_XH_FROM_DATABUS_OUTPUT.1
LOAD_XH_FROM_DATABUS_LOAD: IC5.9(C:I0) LOAD_XH_FROM_DATABUS_INPUT.3
LOAD_XH_FROM_DATABUS_MOV: IC5.4(B:I0) LOAD_XH_FROM_DATABUS_INPUT.2
LOAD_XH_FROM_DATABUS_MOV_ALU_OUT: IC5.5(B:I1) LOAD_XH_FROM_DATABUS_INPUT.1
LOAD_XL_FROM_DATABUS: IC5.3(A:O) LOAD_XL_FROM_DATABUS_OUTPUT.1
LOAD_XL_FROM_DATABUS_IN: IC5.1(A:I0) LOAD_XL_FROM_DATABUS_INPUT.4
LOAD_XL_FROM_DATABUS_LOAD: IC4.12(D:I0) LOAD_XL_FROM_DATABUS_INPUT.3
LOAD_XL_FROM_DATABUS_MOV: IC4.9(C:I0) LOAD_XL_FROM_DATABUS_INPUT.2
LOAD_XL_FROM_DATABUS_MOV_ALU_OUT: IC4.10(C:I1) LOAD_XL_FROM_DATABUS_INPUT.1
LOAD_Y_FROM_ADDRESSBUS: LOAD_Y_FROM_ADDRESSBUS_INPUT.1 LOAD_Y_FROM_ADDRESSBUS_OUTPUT.1
LOAD_Z_FROM_ADDRESSBUS: LOAD_Z_FROM_ADDRESSBUS_INPUT.1 LOAD_Z_FROM_ADDRESSBUS_OUTPUT.1
N$1: ENABLE_ALU_DECODER_INPUT.1 IC15.5(B:I1)
N$2: IC4.8(C:O) IC4.13(D:I1)
N$3: IC1.3(A:O) IC1.5(B:I1)
N$4: IC1.8(C:O) IC1.13(D:I1)
N$5: IC2.3(A:O) IC2.5(B:I1)
N$6: IC2.8(C:O) IC2.13(D:I1)
N$7: IC3.3(A:O) IC3.5(B:I1)
N$8: IC3.8(C:O) IC3.13(D:I1)
N$9: IC4.3(A:O) IC4.5(B:I1)
N$10: IC15.4(B:I0) SELECT_INSTRUCTION_TO_ALU_INPUT.1
N$11: IC5.6(B:O) IC5.10(C:I1)
N$12: IC4.11(D:O) IC5.2(A:I1)
N$13: IC6.6(B:O) IC6.10(C:I1)
N$14: IC6.11(D:O) IC7.2(A:I1)
N$15: IC7.6(B:O) IC7.10(C:I1)
N$16: IC7.11(D:O) IC8.2(A:I1)
N$17: IC8.6(B:O) IC8.10(C:I1)
N$18: IC8.11(D:O) IC9.2(A:I1)
N$19: IC9.8(C:O) IC9.13(D:I1)
N$20: IC9.3(A:O) IC9.5(B:I1)
N$21: IC11.6(B:O) IC11.10(C:I1)
N$22: IC10.3(A:O) IC10.5(B:I1)
N$23: IC12.11(D:O) IC13.2(A:I1)
N$24: IC10.6(B:O) IC10.10(C:I1)
N$25: IC11.8(C:O) IC11.13(D:I1)
N$26: IC10.8(C:O) IC10.13(D:I1)
N$27: IC14.3(A:O) IC14.5(B:I1)
N$28: IC11.11(D:O) IC12.2(A:I1)
N$29: IC13.3(A:O) IC13.5(B:I1)
N$30: IC12.3(A:O) IC12.5(B:I1)
N$31: IC14.8(C:O) IC14.13(D:I1)
N$32: IC12.6(B:O) IC12.10(C:I1)
N$33: IC13.6(B:O) IC13.10(C:I1)
N$35: IC13.8(C:O) IC13.13(D:I1)
N$36: IC16.3(A:O) IC16.5(B:I1)
N$37: IC18.6(B:O) IC18.10(C:I1)
N$38: IC16.6(B:O) IC16.10(C:I1)
N$39: IC15.11(D:O) IC18.2(A:I1)
N$40: IC16.8(C:O) IC16.13(D:I1)
N$42: IC16.11(D:O) IC17.2(A:I1)
SELECT_A_TO_ALU: SELECT_A_TO_ALU_INPUT.1 SELECT_A_TO_ALU_OUTPUT.1
SELECT_ADDER16BIT_INPUTA: SELECT_ADDER16BIT_INPUTA_INPUT.1 SELECT_ADDER16BIT_INPUTA_OUTPUT.1
SELECT_ADDER16BIT_INPUTB: SELECT_ADDER16BIT_INPUTB_INPUT.1 SELECT_ADDER16BIT_INPUTB_OUTPUT.1
SELECT_ADDER16BIT_OUTPUTC: SELECT_ADDER16BIT_OUTPUTC_INPUT.1 SELECT_ADDER16BIT_OUTPUTC_OUTPUT.1
SELECT_B_TO_ALU: SELECT_B_TO_ALU_INPUT.1 SELECT_B_TO_ALU_OUTPUT.1
SELECT_BP_TO_ADDRESSBUS: SELECT_BP_TO_ADDRESSBUS_INPUT.1 SELECT_BP_TO_ADDRESSBUS_OUTPUT.1
SELECT_C_TO_DATABUS: IC6.3(A:O) SELECT_C_TO_DATABUS_OUTPUT.1
SELECT_C_TO_DATABUS_MOV_ALU_C_TO_AB: IC6.1(A:I0) SELECT_C_TO_DATABUS_INPUT.2
SELECT_C_TO_DATABUS_MOV_ALU_OUT: IC6.2(A:I1) SELECT_C_TO_DATABUS_INPUT.1
SELECT_D_TO_DATABUS: SELECT_D_TO_DATABUS_OUTPUT.1
SELECT_D_TO_DATABUS_MOV: IC6.4(B:I0) SELECT_D_TO_DATABUS.2
SELECT_D_TO_DATABUS_MOV_ALU_IN: IC6.5(B:I1) SELECT_D_TO_DATABUS.1
SELECT_D_TO_DATABUS_STORE: IC6.9(C:I0) SELECT_D_TO_DATABUS.3
SELECT_E_TO_DATABUS: IC7.3(A:O) SELECT_E_TO_DATABUS_OUTPUT.1
SELECT_E_TO_DATABUS_MOV: IC6.12(D:I0) SELECT_E_TO_DATABUS_INPUT.2
SELECT_E_TO_DATABUS_MOV_ALU_IN: IC6.13(D:I1) SELECT_E_TO_DATABUS_INPUT.1
SELECT_E_TO_DATABUS_STORE: IC7.1(A:I0) SELECT_E_TO_DATABUS_INPUT.3
SELECT_F_TO_DATABUS: IC7.8(C:O) SELECT_F_TO_DATABUS_OUTPUT.1
SELECT_F_TO_DATABUS_MOV: IC7.4(B:I0) SELECT_F_TO_DATABUS_INPUT.2
SELECT_F_TO_DATABUS_MOV_ALU_IN: IC7.5(B:I1) SELECT_F_TO_DATABUS_INPUT.1
SELECT_F_TO_DATABUS_STORE: IC7.9(C:I0) SELECT_F_TO_DATABUS_INPUT.3
SELECT_FLAGS: IC13.11(D:O) SELECT_FLAGS_OUTPUT.1
SELECT_FLAGS_FLAGS_TO_OUTBUFFER: IC13.12(D:I0) SELECT_FLAGS_INPUT.6
SELECT_FLAGS_JNC: IC13.9(C:I0) SELECT_FLAGS_INPUT.5
SELECT_FLAGS_JNS: IC13.4(B:I0) SELECT_FLAGS_INPUT.4
SELECT_FLAGS_JNZ: IC13.1(A:I0) SELECT_FLAGS_INPUT.3
SELECT_FLAGS_JZ: IC12.13(D:I1) SELECT_FLAGS_INPUT.1
SELECT_FLAGS_SAVE_FLAGS: IC12.12(D:I0) SELECT_FLAGS_INPUT.2
SELECT_FLAGS_TO_DATABUS: SELECT_FLAGS_TO_DATABUS_INPUT.1 SELECT_FLAGS_TO_DATABUS_OUTPUT.1
SELECT_FLAGSTOFLAGSBUS: SELECT_FLAGSTOFLAGSBUS_INPUT.1 SELECT_FLAGSTOFLAGSBUS_OUTPUT.1
SELECT_G_TO_DATABUS: IC8.3(A:O) SELECT_G_TO_DATABUS_OUTPUT.1
SELECT_G_TO_DATABUS_MOV: IC7.12(D:I0) SELECT_G_TO_DATABUS_INPUT.2
SELECT_G_TO_DATABUS_MOV_ALU_IN: IC7.13(D:I1) SELECT_G_TO_DATABUS_INPUT.1
SELECT_G_TO_DATABUS_STORE: IC8.1(A:I0) SELECT_G_TO_DATABUS_INPUT.3
SELECT_H_TO_DATABUS: IC8.8(C:O) SELECT_H_TO_DATABUS_OUTPUT.1
SELECT_H_TO_DATABUS_MOV: IC8.4(B:I0) SELECT_H_TO_DATABUS_INPUT.2
SELECT_H_TO_DATABUS_MOV_ALU_IN: IC8.5(B:I1) SELECT_H_TO_DATABUS_INPUT.1
SELECT_H_TO_DATABUS_STORE: IC8.9(C:I0) SELECT_H_TO_DATABUS_INPUT.3
SELECT_INC: SELECT_INC_INPUT.1 SELECT_INC_OUTPUT.1
SELECT_INSTR_TO_DATABUS: SELECT_INSTR_TO_DATABUS_INPUT.1 SELECT_INSTR_TO_DATABUS_OUTPUT.1
SELECT_INTERNALA_TO_DATABUS: SELECT_INTERNALA_TO_DATABUS_INPUT.1 SELECT_INTERNALA_TO_DATABUS_OUTPUT.1
SELECT_J_TO_ADDRESSBUS: IC12.8(C:O) SELECT_J_TO_ADDRESSBUS_OUTPUT.1
SELECT_J_TO_ADDRESSBUS_ADDER_16BIT: IC12.9(C:I0) SELECT_J_TO_ADDRESSBUS_INPUT.7
SELECT_J_TO_ADDRESSBUS_JMP: IC11.4(B:I0) SELECT_J_TO_ADDRESSBUS_INPUT.2
SELECT_J_TO_ADDRESSBUS_JNC: IC12.4(B:I0) SELECT_J_TO_ADDRESSBUS_INPUT.6
SELECT_J_TO_ADDRESSBUS_JNS: IC11.12(D:I0) SELECT_J_TO_ADDRESSBUS_INPUT.4
SELECT_J_TO_ADDRESSBUS_JNZ: IC12.1(A:I0) SELECT_J_TO_ADDRESSBUS_INPUT.5
SELECT_J_TO_ADDRESSBUS_JZ: IC11.9(C:I0) SELECT_J_TO_ADDRESSBUS_INPUT.3
SELECT_J_TO_ADDRESSBUS_MOV16: IC11.5(B:I1) SELECT_J_TO_ADDRESSBUS_INPUT.1
SELECT_M_TO_ADDRESSBUS: IC10.11(D:O) SELECT_M_TO_ADDRESSBUS_OUTPUT.1
SELECT_M_TO_ADDRESSBUS_LOAD: IC10.1(A:I0) SELECT_M_TO_ADDRESSBUS_INPUT.2
SELECT_M_TO_ADDRESSBUS_LOAD_FLAGS: IC10.4(B:I0) SELECT_M_TO_ADDRESSBUS_INPUT.3
SELECT_M_TO_ADDRESSBUS_MOV16: IC10.2(A:I1) SELECT_M_TO_ADDRESSBUS_INPUT.1
SELECT_M_TO_ADDRESSBUS_STORE: IC10.9(C:I0) SELECT_M_TO_ADDRESSBUS_INPUT.4
SELECT_M_TO_ADDRESSBUS_STORE_FLAGS: IC10.12(D:I0) SELECT_M_TO_ADDRESSBUS_INPUT.5
SELECT_PC: SELECT_PC_INPUT.1 SELECT_PC_OUTPUT.1
SELECT_PORTA_TO_DATABUS: SELECT_PORTA_TO_DATABUS_INPUT.1 SELECT_PORTA_TO_DATABUS_OUTPUT.1
SELECT_PORTB_TO_DATABUS: SELECT_PORTB_TO_DATABUS_INPUT.1 SELECT_PORTB_TO_DATABUS_OUTPUT.1
SELECT_SP_TO_ADDRESSBUS: SELECT_SP_TO_ADDRESSBUS_INPUT.1 SELECT_SP_TO_ADDRESSBUS_OUTPUT.1
SELECT_SRAM: IC14.11(D:O) SELECT_SRAM_OUTPUT.1
SELECT_SRAM_FETCH: IC14.10(C:I1) SELECT_SRAM_INPUT.1
SELECT_SRAM_LOAD: IC14.9(C:I0) SELECT_SRAM_INPUT.2
SELECT_SRAM_LOAD_FLAGS: IC14.12(D:I0) SELECT_SRAM_INPUT.3
SELECT_X_TO_ADDRESSBUS: SELECT_X_TO_ADDRESSBUS_OUTPUT.1
SELECT_X_TO_ADDRESSBUS_ADDER_16BIT: IC11.1(A:I0) SELECT_X_TO_ADDRESSBUS.2
SELECT_X_TO_ADDRESSBUS_MOV16: IC11.2(A:I1) SELECT_X_TO_ADDRESSBUS.1
SELECT_XE_TO_DATABUS: IC18.3(A:O) SELECT_XE_TO_DATABUS_OUTPUT.1
SELECT_XE_TO_DATABUS_MOV: IC15.12(D:I0) SELECT_XE_TO_DATABUS_INPUT.2
SELECT_XE_TO_DATABUS_MOV_ALU_IN: IC15.13(D:I1) SELECT_XE_TO_DATABUS_INPUT.1
SELECT_XE_TO_DATABUS_STORE: IC18.1(A:I0) SELECT_XE_TO_DATABUS_INPUT.3
SELECT_XH_TO_DATABUS: IC9.11(D:O) SELECT_XH_TO_DATABUS_OUTPUT.1
SELECT_XH_TO_DATABUS_MOV: IC9.9(C:I0) SELECT_XH_TO_DATABUS_INPUT.2
SELECT_XH_TO_DATABUS_MOV_ALU_IN: IC9.10(C:I1) SELECT_XH_TO_DATABUS_INPUT.1
SELECT_XH_TO_DATABUS_STORE: IC9.12(D:I0) SELECT_XH_TO_DATABUS_INPUT.3
SELECT_XL_TO_DATABUS: IC9.6(B:O) SELECT_XL_TO_DATABUS_OUTPUT.1
SELECT_XL_TO_DATABUS_MOV: IC8.12(D:I0) SELECT_XL_TO_DATABUS_INPUT.2
SELECT_XL_TO_DATABUS_MOV_ALU_IN: IC8.13(D:I1) SELECT_XL_TO_DATABUS_INPUT.1
SELECT_XL_TO_DATABUS_OUT: IC9.4(B:I0) SELECT_XL_TO_DATABUS_INPUT.4
SELECT_XL_TO_DATABUS_STORE: IC9.1(A:I0) SELECT_XL_TO_DATABUS_INPUT.3
SELECT_Y_TO_ADDRESSBUS: SELECT_Y_TO_ADDRESSBUS_INPUT.1 SELECT_Y_TO_ADDRESSBUS_OUTPUT.1
SELECT_Z_TO_ADDRESSBUS: SELECT_Z_TO_ADDRESSBUS_INPUT.1 SELECT_Z_TO_ADDRESSBUS_OUTPUT.1
STOPCPU: STOPCPU_INPUT.1 STOPCPU_OUTPUT.1
Unconnected: IC6.8(C:O) IC11.3(A:O) IC15.8(C:O) IC15.9(C:I0) IC15.10(C:I1) IC17.3(A:O) IC17.4(B:I0) IC17.5(B:I1) IC17.6(B:O) IC17.8(C:O) IC17.9(C:I0) IC17.10(C:I1) IC17.11(D:O) IC17.12(D:I0) IC17.13(D:I1) IC18.11(D:O) IC18.12(D:I0) IC18.13(D:I1) LOAD_PC_INPUT.7 LOAD_SRAM_INPUT.2 SELECT_PC_INPUT.2

### Power pins joined to a net without a drawn wire
GND: IC1.7(P:GND) IC2.7(P:GND) IC3.7(P:GND) IC4.7(P:GND) IC5.7(P:GND) IC6.7(P:GND) IC7.7(P:GND) IC8.7(P:GND) IC9.7(P:GND) IC10.7(P:GND) IC11.7(P:GND) IC12.7(P:GND) IC13.7(P:GND) IC14.7(P:GND) IC15.7(P:GND) IC16.7(P:GND) IC17.7(P:GND) IC18.7(P:GND)
VCC: IC1.14(P:VCC) IC2.14(P:VCC) IC3.14(P:VCC) IC4.14(P:VCC) IC5.14(P:VCC) IC6.14(P:VCC) IC7.14(P:VCC) IC8.14(P:VCC) IC9.14(P:VCC) IC10.14(P:VCC) IC11.14(P:VCC) IC12.14(P:VCC) IC13.14(P:VCC) IC14.14(P:VCC) IC15.14(P:VCC) IC16.14(P:VCC) IC17.14(P:VCC) IC18.14(P:VCC)

### Library data of the parts
ALU_INSTRUCTION_OUTPUT ENABLE_ALU_DECODER_INPUT INCREMENTER_INPUT INCREMENTER_OUTPUT LOAD_A_FROM_DATABUS_OUTPUT LOAD_ADDER16BIT_INPUTA_INPUT LOAD_ADDER16BIT_INPUTA_OUTPUT LOAD_ADDER16BIT_INPUTB_INPUT LOAD_ADDER16BIT_INPUTB_OUTPUT LOAD_ADDER16BIT_OUTPUTC_INPUT LOAD_ADDER16BIT_OUTPUTC_OUTPUT LOAD_B_FROM_DATABUS_OUTPUT LOAD_BP_FROM_ADDRESSBUS_INPUT LOAD_BP_FROM_ADDRESSBUS_OUTPUT LOAD_C_FROM_DATABUS_INPUT LOAD_C_FROM_DATABUS_OUTPUT LOAD_D_FROM_DATABUS_OUTPUT LOAD_E_FROM_DATABUS_OUTPUT LOAD_F_FROM_DATABUS_OUTPUT LOAD_FLAGS_FROM_DATABUS_INPUT LOAD_FLAGS_FROM_DATABUS_OUTPUT LOAD_FLAGS_FROM_FLAGSBUS_INPUT LOAD_FLAGS_FROM_FLAGSBUS_OUTPUT LOAD_FLAGS_OUTPUT LOAD_FLAGSSAVED_FROM_FLAGS_REGISTER_INPUT LOAD_FLAGSSAVED_FROM_FLAGS_REGISTER_OUTPUT LOAD_FLAGSSAVED_TO_FLAGS_REGISTER_INPUT LOAD_FLAGSSAVED_TO_FLAGS_REGISTER_OUTPUT LOAD_G_FROM_DATABUS_OUTPUT LOAD_H_FROM_DATABUS_OUTPUT LOAD_INC_INPUT LOAD_INC_OUTPUT LOAD_INSTRUCTION_INPUT LOAD_INSTRUCTION_OUTPUT LOAD_INTERNALA_FROM_DATABUS_INPUT LOAD_INTERNALA_FROM_DATABUS_OUTPUT LOAD_J_FROM_ADDRESSBUS_INPUT LOAD_J_FROM_ADDRESSBUS_OUTPUT LOAD_M_FROM_ADDRESSBUS_INPUT LOAD_M_FROM_ADDRESSBUS_OUTPUT LOAD_PC_OUTPUT LOAD_PORTC_FROM_DATABUS_INPUT LOAD_PORTC_FROM_DATABUS_OUTPUT LOAD_PORTD_FROM_DATABUS_INPUT LOAD_PORTD_FROM_DATABUS_OUTPUT LOAD_SP_FROM_ADDRESSBUS_INPUT LOAD_SP_FROM_ADDRESSBUS_OUTPUT LOAD_SRAM_OUTPUT LOAD_X_FROM_ADDRESSBUS_OUTPUT LOAD_XE_FROM_DATABUS_OUTPUT LOAD_XH_FROM_DATABUS_OUTPUT LOAD_XL_FROM_DATABUS_OUTPUT LOAD_Y_FROM_ADDRESSBUS_INPUT LOAD_Y_FROM_ADDRESSBUS_OUTPUT LOAD_Z_FROM_ADDRESSBUS_INPUT LOAD_Z_FROM_ADDRESSBUS_OUTPUT SELECT_A_TO_ALU_INPUT SELECT_A_TO_ALU_OUTPUT SELECT_ADDER16BIT_INPUTA_INPUT SELECT_ADDER16BIT_INPUTA_OUTPUT SELECT_ADDER16BIT_INPUTB_INPUT SELECT_ADDER16BIT_INPUTB_OUTPUT SELECT_ADDER16BIT_OUTPUTC_INPUT SELECT_ADDER16BIT_OUTPUTC_OUTPUT SELECT_B_TO_ALU_INPUT SELECT_B_TO_ALU_OUTPUT SELECT_BP_TO_ADDRESSBUS_INPUT SELECT_BP_TO_ADDRESSBUS_OUTPUT SELECT_C_TO_DATABUS_OUTPUT SELECT_D_TO_DATABUS_OUTPUT SELECT_E_TO_DATABUS_OUTPUT SELECT_F_TO_DATABUS_OUTPUT SELECT_FLAGS_OUTPUT SELECT_FLAGS_TO_DATABUS_INPUT SELECT_FLAGS_TO_DATABUS_OUTPUT SELECT_FLAGSTOFLAGSBUS_INPUT SELECT_FLAGSTOFLAGSBUS_OUTPUT SELECT_G_TO_DATABUS_OUTPUT SELECT_H_TO_DATABUS_OUTPUT SELECT_INC_INPUT SELECT_INC_OUTPUT SELECT_INSTR_TO_DATABUS_INPUT SELECT_INSTR_TO_DATABUS_OUTPUT SELECT_INSTRUCTION_TO_ALU_INPUT SELECT_INTERNALA_TO_DATABUS_INPUT SELECT_INTERNALA_TO_DATABUS_OUTPUT SELECT_J_TO_ADDRESSBUS_OUTPUT SELECT_M_TO_ADDRESSBUS_OUTPUT SELECT_PC_OUTPUT SELECT_PORTA_TO_DATABUS_INPUT SELECT_PORTA_TO_DATABUS_OUTPUT SELECT_PORTB_TO_DATABUS_INPUT SELECT_PORTB_TO_DATABUS_OUTPUT SELECT_SP_TO_ADDRESSBUS_INPUT SELECT_SP_TO_ADDRESSBUS_OUTPUT SELECT_SRAM_OUTPUT SELECT_X_TO_ADDRESSBUS_OUTPUT SELECT_XE_TO_DATABUS_OUTPUT SELECT_XH_TO_DATABUS_OUTPUT SELECT_XL_TO_DATABUS_OUTPUT SELECT_Y_TO_ADDRESSBUS_INPUT SELECT_Y_TO_ADDRESSBUS_OUTPUT SELECT_Z_TO_ADDRESSBUS_INPUT SELECT_Z_TO_ADDRESSBUS_OUTPUT STOPCPU_INPUT STOPCPU_OUTPUT = pinhead:PINHD-1X1: PIN HEADER
IC1-IC18 = 74xx-eu:74*32: Quad 2-input OR gate
LOAD_A_FROM_DATABUS_INPUT LOAD_B_FROM_DATABUS_INPUT LOAD_D_FROM_DATABUS_INPUT LOAD_E_FROM_DATABUS_INPUT LOAD_F_FROM_DATABUS_INPUT LOAD_FLAGS_INPUT LOAD_G_FROM_DATABUS_INPUT LOAD_H_FROM_DATABUS_INPUT LOAD_XE_FROM_DATABUS_INPUT LOAD_XH_FROM_DATABUS_INPUT SELECT_D_TO_DATABUS SELECT_E_TO_DATABUS_INPUT SELECT_F_TO_DATABUS_INPUT SELECT_G_TO_DATABUS_INPUT SELECT_H_TO_DATABUS_INPUT SELECT_SRAM_INPUT SELECT_XE_TO_DATABUS_INPUT SELECT_XH_TO_DATABUS_INPUT = pinhead:PINHD-1X3: PIN HEADER
LOAD_PC_INPUT SELECT_J_TO_ADDRESSBUS_INPUT = pinhead:PINHD-1X7: PIN HEADER
LOAD_SRAM_INPUT LOAD_X_FROM_ADDRESSBUS_INPUT SELECT_C_TO_DATABUS_INPUT SELECT_PC_INPUT SELECT_X_TO_ADDRESSBUS = pinhead:PINHD-1X2: PIN HEADER
LOAD_XL_FROM_DATABUS_INPUT SELECT_XL_TO_DATABUS_INPUT = pinhead:PINHD-1X4: PIN HEADER
SELECT_FLAGS_INPUT = pinhead:PINHD-1X6: PIN HEADER
SELECT_M_TO_ADDRESSBUS_INPUT = pinhead:PINHD-1X5: PIN HEADER